# Altium schematic sheet E2.SchDoc
size 420 x 297 mm; SheetNumber: 2; SheetTotal: 2
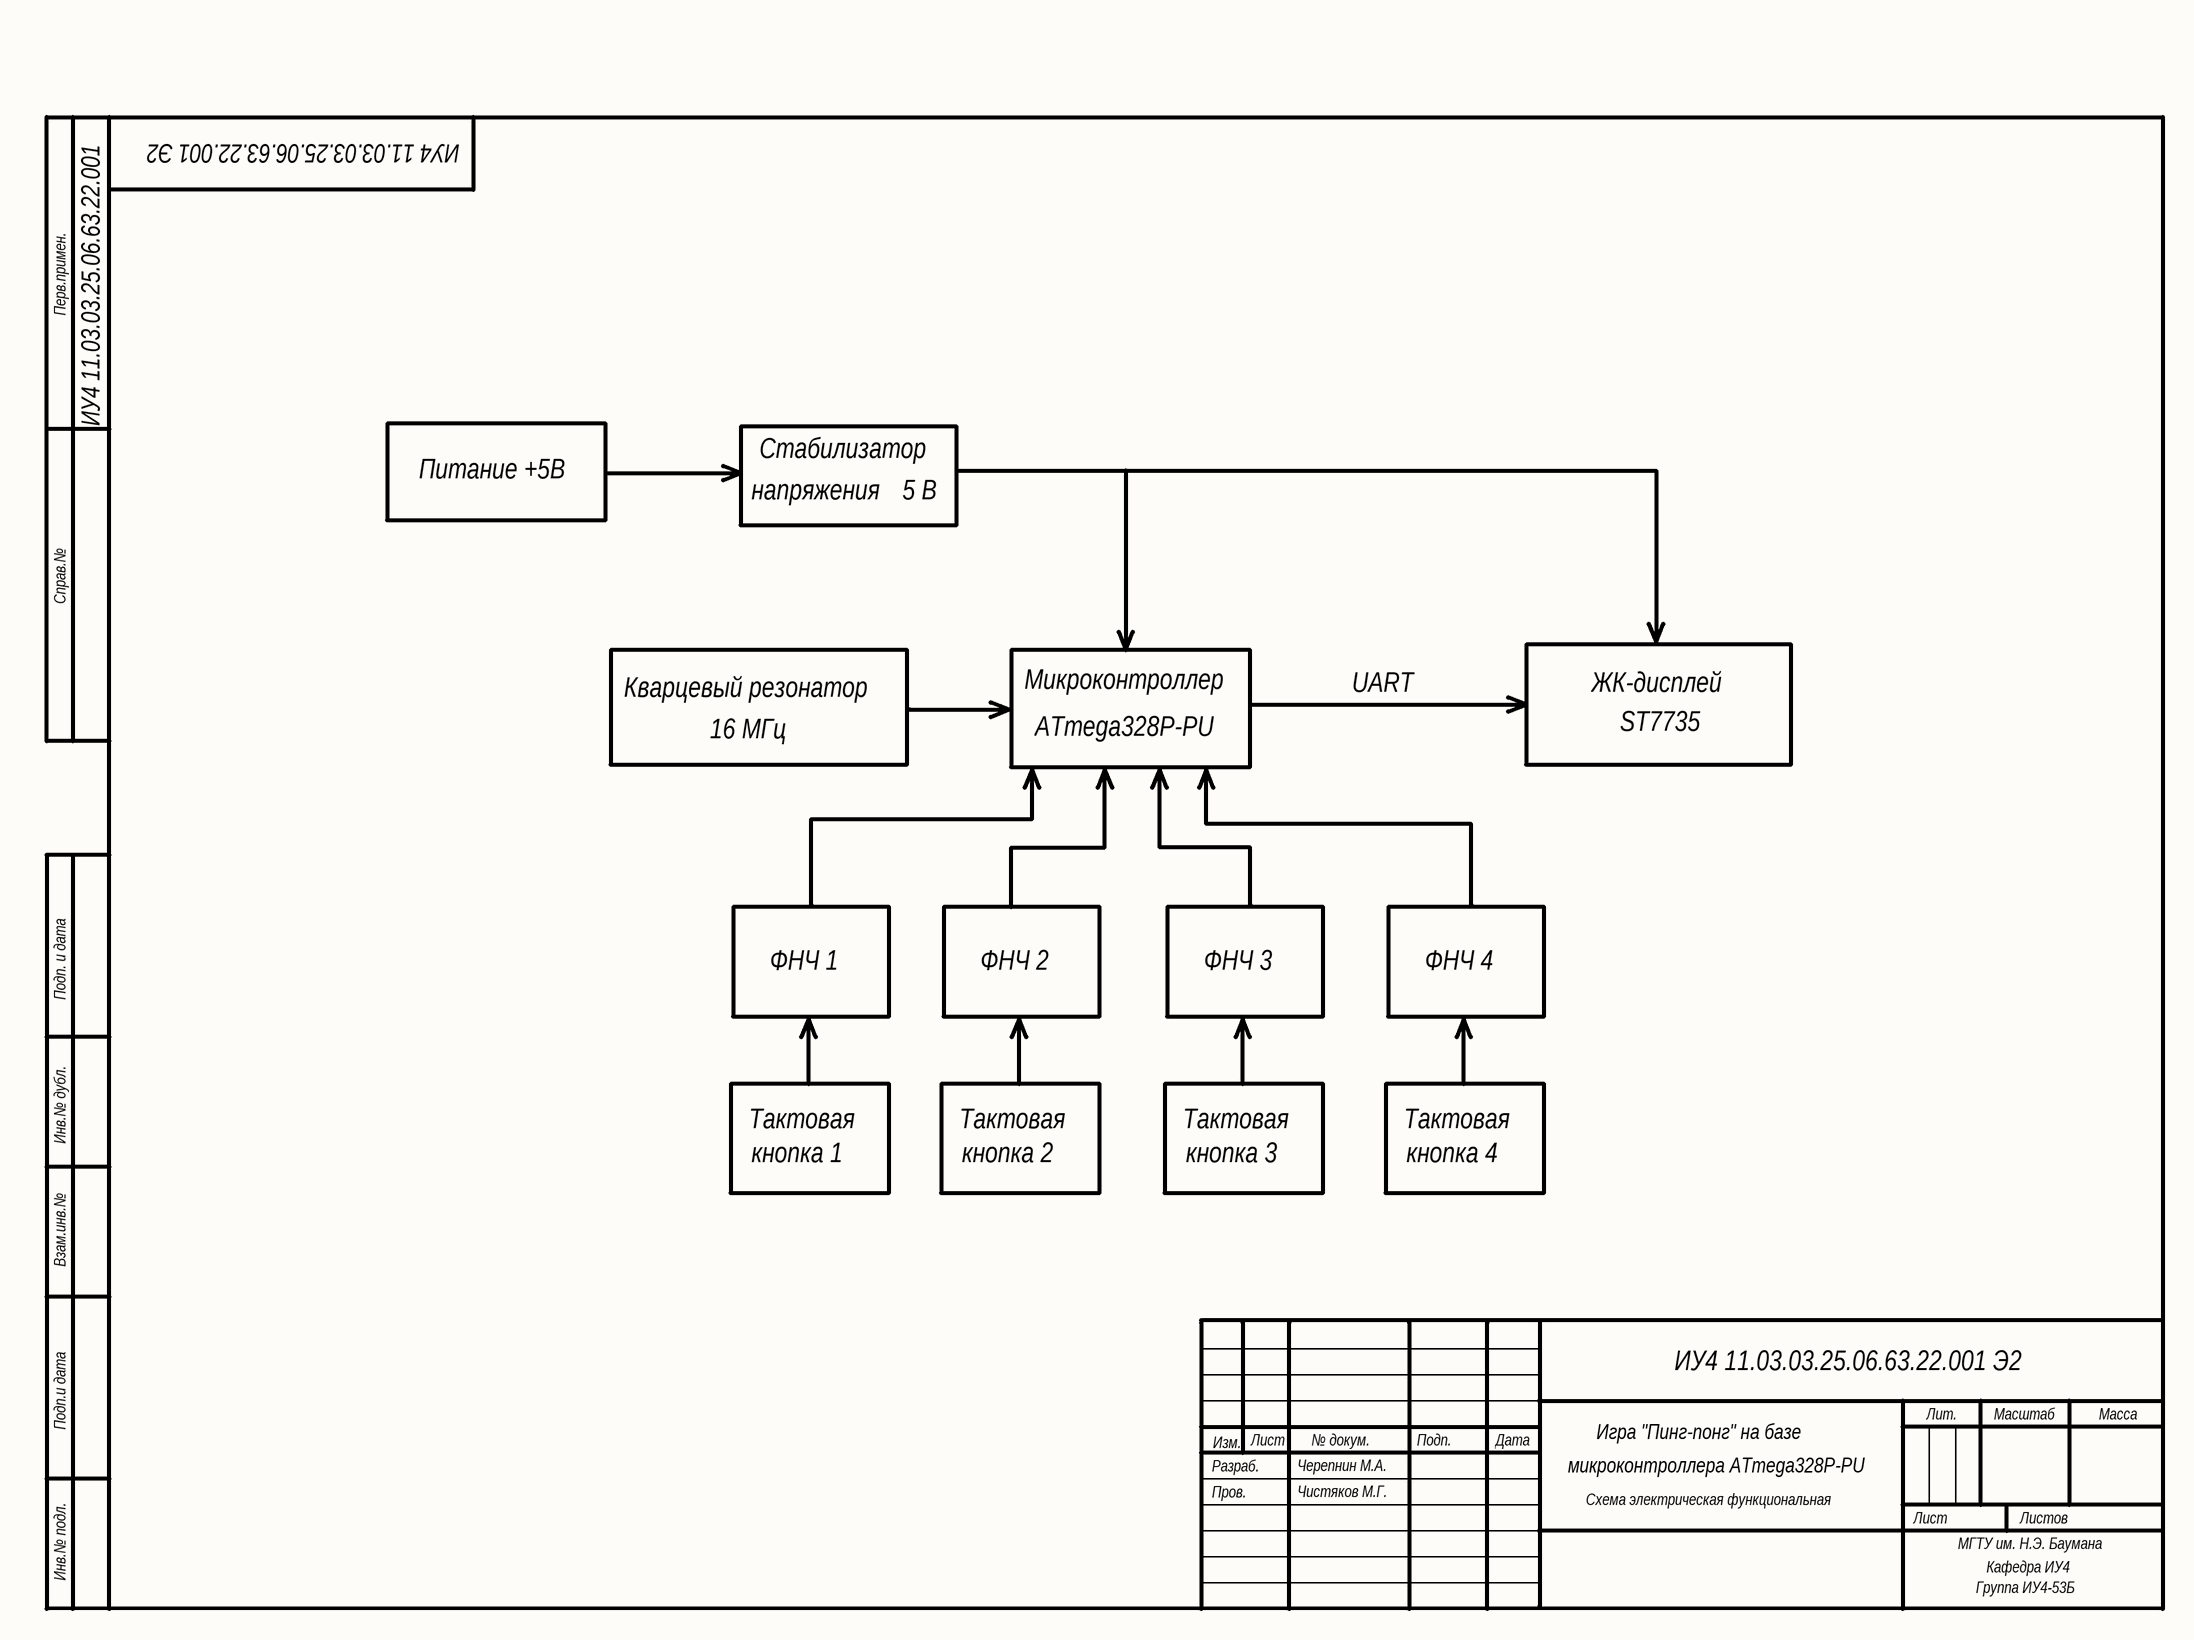
[diagram p0: E2.SchDoc]

## Notes on the sheet
- ИУ4 11.03.03.25.06.63.22.001 Э2
- ИУ4 11.03.03.25.06.63.22.001
- Стабилизатор
- Питание +5В
- напряжения
- 5 В
- Кварцевый резонатор
- Микроконтроллер
- ATmega328P-PU
- UART
- ЖК-дисплей
- ST7735
- 16 МГц
- ФНЧ 1
- ФНЧ 2
- ФНЧ 3
- ФНЧ 4
- Тактовая
- кнопка 1
- кнопка 2
- кнопка 3
- кнопка 4
- Игра "Пинг-понг" на базе
- Черепнин М.А.
- Чистяков М.Г.
- микроконтроллера ATmega328P-PU
- Схема электрическая функциональная
- МГТУ им. Н.Э. Баумана
- Группа ИУ4-53Б
- Кафедра ИУ4
- Перв.примен.
- Справ.№
- Подп. и дата
- Инв.№ дубл.
- Взам.инв.№
- Подп.и дата
- Разраб.
- Изм.
- Лист
- № докум.
- Подп.
- Дата
- Лит.
- Масштаб
- Масса
- Пров.
- Листов
- Инв.№ подл.